# Altium schematic sheet BlockdiagramSTM32.SchDoc
size A3; SheetNumber: 1; SheetTotal: 3
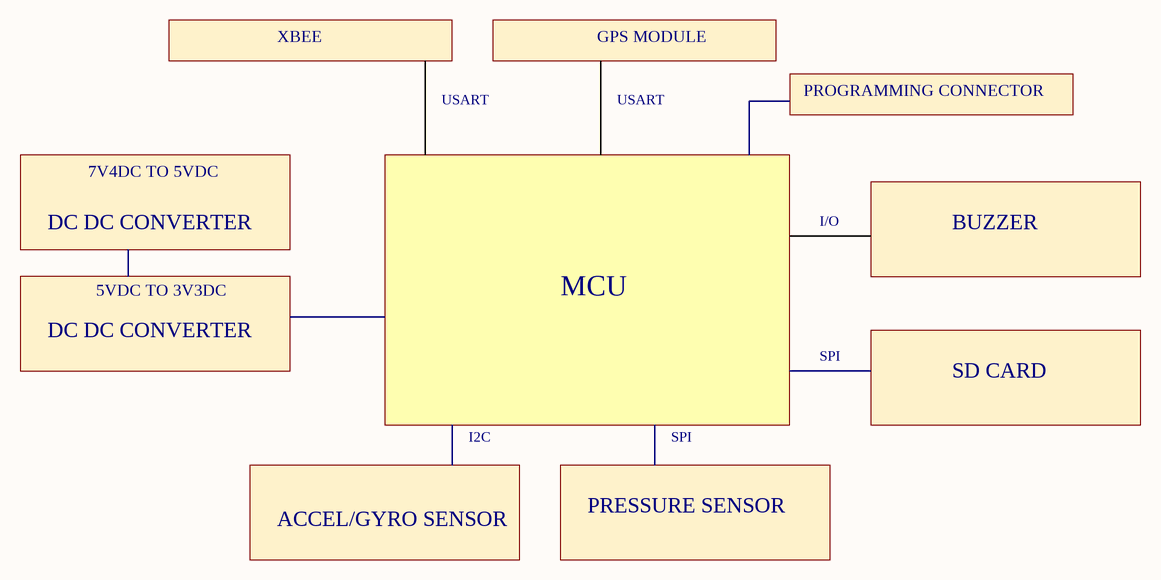
[diagram p0: BlockdiagramSTM32.SchDoc]

## Notes on the sheet
- XBEE
- GPS MODULE
- USART
- PROGRAMMING CONNECTOR
- 7V4DC TO 5VDC
- I/O
- DC DC CONVERTER
- 5VDC TO 3V3DC
- BUZZER
- MCU
- SPI
- SD CARD
- I2C
- ACCEL/GYRO SENSOR
- PRESSURE SENSOR
- Document Name
- Prepared By
- Company Name
- Checked By
- A. Can KARACAN
- Release Date
- Department
- R&D- Hardware
- Size
- Change Date
- A3
- Approved By
- Sheet
- /